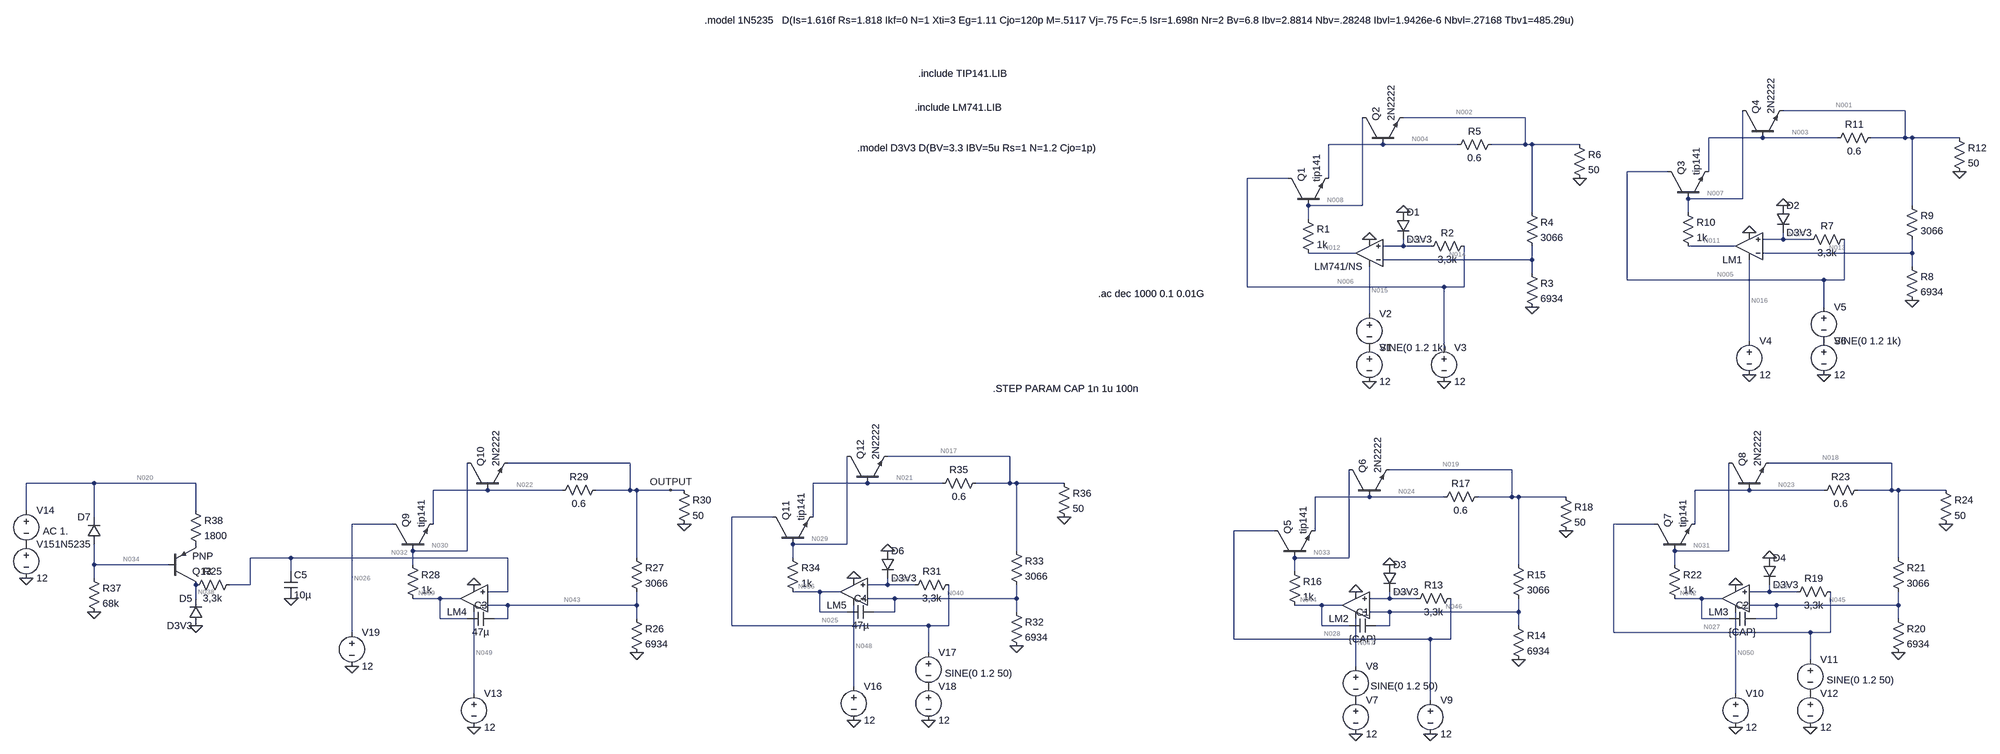
[diagram p0: schematic Estabilizador 5 V.asc]
Estabilizador 5 V.asc, the LTspice schematic file:
Version 4
SHEET 1 1496 1604
WIRE 1296 112 1008 112
WIRE 400 128 112 128
WIRE 960 176 832 176
WIRE 1136 176 960 176
WIRE 1296 176 1296 112
WIRE 1296 176 1216 176
WIRE 1312 176 1296 176
WIRE 1424 176 1312 176
WIRE 64 192 -64 192
WIRE 240 192 64 192
WIRE 400 192 400 128
WIRE 400 192 320 192
WIRE 416 192 400 192
WIRE 528 192 416 192
WIRE 736 256 640 256
WIRE 832 256 832 176
WIRE -160 272 -256 272
WIRE -64 272 -64 192
WIRE 912 320 912 112
WIRE 912 320 784 320
WIRE 16 336 16 128
WIRE 16 336 -112 336
WIRE 1312 336 1312 176
WIRE 416 352 416 192
WIRE 784 352 784 320
WIRE -112 368 -112 336
WIRE 1008 416 1008 400
WIRE 1008 416 960 416
WIRE 1072 416 1008 416
WIRE 112 432 112 416
WIRE 112 432 64 432
WIRE 176 432 112 432
WIRE 896 432 784 432
WIRE 0 448 -112 448
WIRE 1312 448 1312 416
WIRE 1312 448 960 448
WIRE 416 464 416 432
WIRE 416 464 64 464
WIRE 1312 480 1312 448
WIRE 416 496 416 464
WIRE 640 512 640 256
WIRE 1104 512 640 512
WIRE 1152 512 1152 416
WIRE 1152 512 1104 512
WIRE -256 528 -256 272
WIRE 208 528 -256 528
WIRE 256 528 256 432
WIRE 256 528 208 528
WIRE 1104 576 1104 512
WIRE 32 592 32 480
WIRE 928 656 928 464
WIRE 208 672 208 528
WIRE -816 928 -1104 928
WIRE -1712 944 -2000 944
WIRE 1264 944 976 944
WIRE 368 960 80 960
WIRE -2976 992 -3136 992
WIRE -2736 992 -2976 992
WIRE -1152 992 -1280 992
WIRE -976 992 -1152 992
WIRE -816 992 -816 928
WIRE -816 992 -896 992
WIRE -800 992 -816 992
WIRE -688 992 -800 992
WIRE -2048 1008 -2176 1008
WIRE -1872 1008 -2048 1008
WIRE -1712 1008 -1712 944
WIRE -1712 1008 -1792 1008
WIRE -1696 1008 -1712 1008
WIRE -1616 1008 -1696 1008
WIRE -1584 1008 -1616 1008
WIRE 928 1008 800 1008
WIRE 1104 1008 928 1008
WIRE 1264 1008 1264 944
WIRE 1264 1008 1184 1008
WIRE 1280 1008 1264 1008
WIRE 1392 1008 1280 1008
WIRE 32 1024 -96 1024
WIRE 208 1024 32 1024
WIRE 368 1024 368 960
WIRE 368 1024 288 1024
WIRE 384 1024 368 1024
WIRE 496 1024 384 1024
WIRE -3136 1056 -3136 992
WIRE -2736 1056 -2736 992
WIRE -2976 1072 -2976 992
WIRE -1376 1072 -1472 1072
WIRE -1280 1072 -1280 992
WIRE -2272 1088 -2368 1088
WIRE -2176 1088 -2176 1008
WIRE 704 1088 608 1088
WIRE 800 1088 800 1008
WIRE -192 1104 -288 1104
WIRE -96 1104 -96 1024
WIRE -1200 1136 -1200 928
WIRE -1200 1136 -1328 1136
WIRE -2096 1152 -2096 944
WIRE -2096 1152 -2224 1152
WIRE -800 1152 -800 992
WIRE 880 1152 880 944
WIRE 880 1152 752 1152
WIRE -2512 1168 -2608 1168
WIRE -2000 1168 -2512 1168
WIRE -1696 1168 -1696 1008
WIRE -1328 1168 -1328 1136
WIRE -16 1168 -16 960
WIRE -16 1168 -144 1168
WIRE 1280 1168 1280 1008
WIRE -2976 1184 -2976 1136
WIRE -2800 1184 -2976 1184
WIRE -2224 1184 -2224 1152
WIRE 384 1184 384 1024
WIRE 752 1184 752 1152
WIRE -2512 1200 -2512 1168
WIRE -144 1200 -144 1168
WIRE -2976 1216 -2976 1184
WIRE -2608 1232 -2608 1168
WIRE -2608 1232 -2656 1232
WIRE -1104 1232 -1104 1216
WIRE -1104 1232 -1152 1232
WIRE -1040 1232 -1104 1232
WIRE -2000 1248 -2000 1168
WIRE -2000 1248 -2048 1248
WIRE -1264 1248 -1328 1248
WIRE -1216 1248 -1264 1248
WIRE 976 1248 976 1232
WIRE 976 1248 928 1248
WIRE 1040 1248 976 1248
WIRE -2736 1264 -2736 1232
WIRE -2160 1264 -2224 1264
WIRE -2112 1264 -2160 1264
WIRE -1088 1264 -1152 1264
WIRE -800 1264 -800 1232
WIRE -800 1264 -1088 1264
WIRE 80 1264 80 1248
WIRE 80 1264 32 1264
WIRE 144 1264 80 1264
WIRE 816 1264 752 1264
WIRE 864 1264 816 1264
WIRE -2000 1280 -2048 1280
WIRE -1696 1280 -1696 1248
WIRE -1696 1280 -2000 1280
WIRE -80 1280 -144 1280
WIRE -32 1280 -80 1280
WIRE 992 1280 928 1280
WIRE 1280 1280 1280 1248
WIRE 1280 1280 992 1280
WIRE -1264 1296 -1264 1248
WIRE -1200 1296 -1264 1296
WIRE -1088 1296 -1088 1264
WIRE -1088 1296 -1136 1296
WIRE -800 1296 -800 1264
WIRE 80 1296 32 1296
WIRE 384 1296 384 1264
WIRE 384 1296 80 1296
WIRE -2160 1312 -2160 1264
WIRE -2096 1312 -2160 1312
WIRE -2000 1312 -2000 1280
WIRE -2000 1312 -2032 1312
WIRE -1696 1312 -1696 1280
WIRE 816 1312 816 1264
WIRE 880 1312 816 1312
WIRE 992 1312 992 1280
WIRE 992 1312 944 1312
WIRE 1280 1312 1280 1280
WIRE -1472 1328 -1472 1072
WIRE -1008 1328 -1472 1328
WIRE -960 1328 -960 1232
WIRE -960 1328 -1008 1328
WIRE -80 1328 -80 1280
WIRE -16 1328 -80 1328
WIRE 80 1328 80 1296
WIRE 80 1328 48 1328
WIRE 384 1328 384 1296
WIRE -2368 1344 -2368 1088
WIRE 608 1344 608 1088
WIRE 1072 1344 608 1344
WIRE 1120 1344 1120 1248
WIRE 1120 1344 1072 1344
WIRE -288 1360 -288 1104
WIRE 176 1360 -288 1360
WIRE 224 1360 224 1264
WIRE 224 1360 176 1360
WIRE -1008 1392 -1008 1328
WIRE 1072 1408 1072 1344
WIRE 0 1424 0 1312
WIRE -1184 1472 -1184 1280
WIRE -2080 1488 -2080 1296
WIRE 896 1488 896 1296
WIRE 176 1504 176 1360
FLAG 32 416 0
FLAG 32 752 0
FLAG 416 576 0
FLAG 112 352 0
FLAG 528 272 0
FLAG 208 752 0
FLAG 928 400 0
FLAG 928 736 0
FLAG 1312 560 0
FLAG 1008 336 0
FLAG 1424 256 0
FLAG 1104 736 0
FLAG 0 1248 0
FLAG 0 1584 0
FLAG 384 1408 0
FLAG 80 1184 0
FLAG 496 1104 0
FLAG 176 1584 0
FLAG 896 1232 0
FLAG 896 1568 0
FLAG 1280 1392 0
FLAG 976 1168 0
FLAG 1392 1088 0
FLAG 1072 1568 0
FLAG -2080 1232 0
FLAG -2080 1568 0
FLAG -1696 1392 0
FLAG -2736 1328 0
FLAG -1584 1088 0
FLAG -3136 1216 0
FLAG -1184 1216 0
FLAG -1184 1552 0
FLAG -800 1376 0
FLAG -1104 1152 0
FLAG -688 1072 0
FLAG -1008 1552 0
FLAG -2976 1296 0
FLAG -2368 1424 0
FLAG -2512 1264 0
FLAG -1616 1008 OUTPUT
SYMBOL npn -160 336 R270
SYMATTR InstName Q1
SYMATTR Value tip141
SYMATTR Prefix X
SYMBOL voltage 32 656 R0
WINDOW 123 0 0 Left 2
WINDOW 39 0 0 Left 2
SYMATTR InstName V1
SYMATTR Value 12
SYMBOL res 272 416 R90
WINDOW 0 0 56 VBottom 2
WINDOW 3 32 56 VTop 2
SYMATTR InstName R2
SYMATTR Value 3,3k
SYMBOL res 400 480 R0
SYMATTR InstName R3
SYMATTR Value 6934
SYMBOL res 400 336 R0
SYMATTR InstName R4
SYMATTR Value 3066
SYMBOL diode 96 352 R0
SYMATTR InstName D1
SYMATTR Value D3V3
SYMBOL res -128 352 R0
SYMATTR InstName R1
SYMATTR Value 1k
SYMBOL res 336 176 R90
WINDOW 0 0 56 VBottom 2
WINDOW 3 32 56 VTop 2
SYMATTR InstName R5
SYMATTR Value 0.6
SYMBOL res 512 176 R0
SYMATTR InstName R6
SYMATTR Value 50
SYMBOL npn 16 192 R270
SYMATTR InstName Q2
SYMATTR Value 2N2222
SYMBOL Opamps\\UniversalOpamp2 32 448 R180
SYMATTR InstName LM741/NS
SYMBOL voltage 32 576 R0
WINDOW 123 0 0 Left 2
WINDOW 39 0 0 Left 2
SYMATTR InstName V2
SYMATTR Value SINE(0 1.2 1k)
SYMBOL voltage 208 656 R0
WINDOW 123 0 0 Left 2
WINDOW 39 0 0 Left 2
SYMATTR InstName V3
SYMATTR Value 12
SYMBOL npn 736 320 R270
SYMATTR InstName Q3
SYMATTR Value tip141
SYMATTR Prefix X
SYMBOL voltage 928 640 R0
WINDOW 123 0 0 Left 2
WINDOW 39 0 0 Left 2
SYMATTR InstName V4
SYMATTR Value 12
SYMBOL res 1168 400 R90
WINDOW 0 0 56 VBottom 2
WINDOW 3 32 56 VTop 2
SYMATTR InstName R7
SYMATTR Value 3,3k
SYMBOL res 1296 464 R0
SYMATTR InstName R8
SYMATTR Value 6934
SYMBOL res 1296 320 R0
SYMATTR InstName R9
SYMATTR Value 3066
SYMBOL diode 992 336 R0
SYMATTR InstName D2
SYMATTR Value D3V3
SYMBOL res 768 336 R0
SYMATTR InstName R10
SYMATTR Value 1k
SYMBOL res 1232 160 R90
WINDOW 0 0 56 VBottom 2
WINDOW 3 32 56 VTop 2
SYMATTR InstName R11
SYMATTR Value 0.6
SYMBOL res 1408 160 R0
SYMATTR InstName R12
SYMATTR Value 50
SYMBOL npn 912 176 R270
SYMATTR InstName Q4
SYMATTR Value 2N2222
SYMBOL Opamps\\UniversalOpamp2 928 432 R180
SYMATTR InstName LM1
SYMBOL voltage 1104 560 R0
WINDOW 123 0 0 Left 2
WINDOW 39 0 0 Left 2
SYMATTR InstName V5
SYMATTR Value SINE(0 1.2 1k)
SYMBOL voltage 1104 640 R0
WINDOW 123 0 0 Left 2
WINDOW 39 0 0 Left 2
SYMATTR InstName V6
SYMATTR Value 12
SYMBOL npn -192 1168 R270
SYMATTR InstName Q5
SYMATTR Value tip141
SYMATTR Prefix X
SYMBOL voltage 0 1488 R0
WINDOW 123 0 0 Left 2
WINDOW 39 0 0 Left 2
SYMATTR InstName V7
SYMATTR Value 12
SYMBOL res 240 1248 R90
WINDOW 0 0 56 VBottom 2
WINDOW 3 32 56 VTop 2
SYMATTR InstName R13
SYMATTR Value 3,3k
SYMBOL res 368 1312 R0
SYMATTR InstName R14
SYMATTR Value 6934
SYMBOL res 368 1168 R0
SYMATTR InstName R15
SYMATTR Value 3066
SYMBOL diode 64 1184 R0
SYMATTR InstName D3
SYMATTR Value D3V3
SYMBOL res -160 1184 R0
SYMATTR InstName R16
SYMATTR Value 1k
SYMBOL res 304 1008 R90
WINDOW 0 0 56 VBottom 2
WINDOW 3 32 56 VTop 2
SYMATTR InstName R17
SYMATTR Value 0.6
SYMBOL res 480 1008 R0
SYMATTR InstName R18
SYMATTR Value 50
SYMBOL npn -16 1024 R270
SYMATTR InstName Q6
SYMATTR Value 2N2222
SYMBOL Opamps\\UniversalOpamp2 0 1280 R180
SYMATTR InstName LM2
SYMBOL voltage 0 1408 R0
WINDOW 3 35 63 Left 2
WINDOW 123 0 0 Left 2
WINDOW 39 0 0 Left 2
SYMATTR InstName V8
SYMATTR Value SINE(0 1.2 50)
SYMBOL voltage 176 1488 R0
WINDOW 123 0 0 Left 2
WINDOW 39 0 0 Left 2
SYMATTR InstName V9
SYMATTR Value 12
SYMBOL npn 704 1152 R270
SYMATTR InstName Q7
SYMATTR Value tip141
SYMATTR Prefix X
SYMBOL voltage 896 1472 R0
WINDOW 123 0 0 Left 2
WINDOW 39 0 0 Left 2
SYMATTR InstName V10
SYMATTR Value 12
SYMBOL res 1136 1232 R90
WINDOW 0 0 56 VBottom 2
WINDOW 3 32 56 VTop 2
SYMATTR InstName R19
SYMATTR Value 3,3k
SYMBOL res 1264 1296 R0
SYMATTR InstName R20
SYMATTR Value 6934
SYMBOL res 1264 1152 R0
SYMATTR InstName R21
SYMATTR Value 3066
SYMBOL diode 960 1168 R0
SYMATTR InstName D4
SYMATTR Value D3V3
SYMBOL res 736 1168 R0
SYMATTR InstName R22
SYMATTR Value 1k
SYMBOL res 1200 992 R90
WINDOW 0 0 56 VBottom 2
WINDOW 3 32 56 VTop 2
SYMATTR InstName R23
SYMATTR Value 0.6
SYMBOL res 1376 992 R0
SYMATTR InstName R24
SYMATTR Value 50
SYMBOL npn 880 1008 R270
SYMATTR InstName Q8
SYMATTR Value 2N2222
SYMBOL Opamps\\UniversalOpamp2 896 1264 R180
SYMATTR InstName LM3
SYMBOL voltage 1072 1392 R0
WINDOW 3 39 65 Left 2
WINDOW 123 0 0 Left 2
WINDOW 39 0 0 Left 2
SYMATTR InstName V11
SYMATTR Value SINE(0 1.2 50)
SYMBOL voltage 1072 1472 R0
WINDOW 123 0 0 Left 2
WINDOW 39 0 0 Left 2
SYMATTR InstName V12
SYMATTR Value 12
SYMBOL cap 48 1312 R90
WINDOW 0 0 32 VBottom 2
WINDOW 3 32 32 VTop 2
SYMATTR InstName C1
SYMATTR Value {CAP}
SYMBOL cap 944 1296 R90
WINDOW 0 0 32 VBottom 2
WINDOW 3 32 32 VTop 2
SYMATTR InstName C2
SYMATTR Value {CAP}
SYMBOL npn -2272 1152 R270
SYMATTR InstName Q9
SYMATTR Value tip141
SYMATTR Prefix X
SYMBOL voltage -2080 1472 R0
WINDOW 123 0 0 Left 2
WINDOW 39 0 0 Left 2
SYMATTR InstName V13
SYMATTR Value 12
SYMBOL res -2640 1216 R90
WINDOW 0 0 56 VBottom 2
WINDOW 3 32 56 VTop 2
SYMATTR InstName R25
SYMATTR Value 3,3k
SYMBOL res -1712 1296 R0
SYMATTR InstName R26
SYMATTR Value 6934
SYMBOL res -1712 1152 R0
SYMATTR InstName R27
SYMATTR Value 3066
SYMBOL diode -2720 1328 R180
WINDOW 0 24 64 Left 2
WINDOW 3 24 0 Left 2
SYMATTR InstName D5
SYMATTR Value D3V3
SYMBOL res -2240 1168 R0
SYMATTR InstName R28
SYMATTR Value 1k
SYMBOL res -1776 992 R90
WINDOW 0 0 56 VBottom 2
WINDOW 3 32 56 VTop 2
SYMATTR InstName R29
SYMATTR Value 0.6
SYMBOL res -1600 992 R0
SYMATTR InstName R30
SYMATTR Value 50
SYMBOL npn -2096 1008 R270
SYMATTR InstName Q10
SYMATTR Value 2N2222
SYMBOL Opamps\\UniversalOpamp2 -2080 1264 R180
SYMATTR InstName LM4
SYMBOL voltage -3136 1120 R0
WINDOW 123 0 0 Left 2
WINDOW 39 0 0 Left 2
SYMATTR InstName V15
SYMATTR Value 12
SYMBOL npn -1376 1136 R270
SYMATTR InstName Q11
SYMATTR Value tip141
SYMATTR Prefix X
SYMBOL voltage -1184 1456 R0
WINDOW 123 0 0 Left 2
WINDOW 39 0 0 Left 2
SYMATTR InstName V16
SYMATTR Value 12
SYMBOL res -944 1216 R90
WINDOW 0 0 56 VBottom 2
WINDOW 3 32 56 VTop 2
SYMATTR InstName R31
SYMATTR Value 3,3k
SYMBOL res -816 1280 R0
SYMATTR InstName R32
SYMATTR Value 6934
SYMBOL res -816 1136 R0
SYMATTR InstName R33
SYMATTR Value 3066
SYMBOL diode -1120 1152 R0
SYMATTR InstName D6
SYMATTR Value D3V3
SYMBOL res -1344 1152 R0
SYMATTR InstName R34
SYMATTR Value 1k
SYMBOL res -880 976 R90
WINDOW 0 0 56 VBottom 2
WINDOW 3 32 56 VTop 2
SYMATTR InstName R35
SYMATTR Value 0.6
SYMBOL res -704 976 R0
SYMATTR InstName R36
SYMATTR Value 50
SYMBOL npn -1200 992 R270
SYMATTR InstName Q12
SYMATTR Value 2N2222
SYMBOL Opamps\\UniversalOpamp2 -1184 1248 R180
SYMATTR InstName LM5
SYMBOL voltage -1008 1376 R0
WINDOW 3 39 65 Left 2
WINDOW 123 0 0 Left 2
WINDOW 39 0 0 Left 2
SYMATTR InstName V17
SYMATTR Value SINE(0 1.2 50)
SYMBOL voltage -1008 1456 R0
WINDOW 123 0 0 Left 2
WINDOW 39 0 0 Left 2
SYMATTR InstName V18
SYMATTR Value 12
SYMBOL cap -2032 1296 R90
WINDOW 0 0 32 VBottom 2
WINDOW 3 32 32 VTop 2
SYMATTR InstName C3
SYMATTR Value 47µ
SYMBOL cap -1136 1280 R90
WINDOW 0 0 32 VBottom 2
WINDOW 3 32 32 VTop 2
SYMATTR InstName C4
SYMATTR Value 47µ
SYMBOL diode -2960 1136 R180
WINDOW 0 24 64 Left 2
WINDOW 3 24 0 Left 2
SYMATTR InstName D7
SYMATTR Value 1N5235
SYMBOL res -2992 1200 R0
SYMATTR InstName R37
SYMATTR Value 68k
SYMBOL res -2752 1040 R0
SYMATTR InstName R38
SYMATTR Value 1800
SYMBOL pnp -2800 1232 M180
SYMATTR InstName Q13
SYMBOL voltage -2368 1328 R0
WINDOW 123 0 0 Left 2
WINDOW 39 0 0 Left 2
SYMATTR InstName V19
SYMATTR Value 12
SYMBOL voltage -3136 1040 R0
WINDOW 3 39 65 Left 2
WINDOW 123 0 0 Left 2
WINDOW 39 0 0 Left 2
SYMATTR InstName V14
SYMATTR Value AC 1.
SYMBOL cap -2528 1200 R0
SYMATTR InstName C5
SYMATTR Value 10µ
TEXT -1176 200 Left 2 !.model D3V3 D(BV=3.3 IBV=5u Rs=1 N=1.2 Cjo=1p)
TEXT -608 544 Left 2 !.ac dec 1000 0.1 0.01G
TEXT -1032 24 Left 2 !.include TIP141.LIB
TEXT -1040 104 Left 2 !.include LM741.LIB
TEXT -856 768 Left 2 !.STEP PARAM CAP 1n 1u 100n
TEXT -1536 -152 Left 2 !.model 1N5235   D(Is=1.616f Rs=1.818 Ikf=0 N=1 Xti=3 Eg=1.11 Cjo=120p M=.5117 Vj=.75 Fc=.5 Isr=1.698n Nr=2 Bv=6.8 Ibv=2.8814 Nbv=.28248 Ibvl=1.9426e-6 Nbvl=.27168 Tbv1=485.29u)

The netlist it stands for:
* Estabilizador 5 V.asc
XQ1 N006 N008 N004 tip141  ; pins C B E
V1 P001 0 12
R2 N006 N010 3,3k
R3 N014 0 6934
R4 N002 N014 3066
D1 0 N010 D3V3
R1 N008 N012 1k
R5 N002 N004 0.6
R6 N002 0 50
Q2 N008 N004 N002 0 2N2222
XLM741/NS N010 N014 N015 0 N012 level.2 Avol=1Meg GBW=10Meg Slew=10Meg ilimit=25m rail=0 Vos=0 phimargin=45 en=0 enk=0 in=0 ink=0 Rin=500Meg  ; pins IN+ IN- V+ V- OUT
V2 N015 P001 SINE(0 1.2 1k)
V3 N006 0 12
XQ3 N005 N007 N003 tip141  ; pins C B E
V4 N016 0 12
R7 N005 N009 3,3k
R8 N013 0 6934
R9 N001 N013 3066
D2 0 N009 D3V3
R10 N007 N011 1k
R11 N001 N003 0.6
R12 N001 0 50
Q4 N007 N003 N001 0 2N2222
XLM1 N009 N013 N016 0 N011 level.2 Avol=1Meg GBW=10Meg Slew=10Meg ilimit=25m rail=0 Vos=0 phimargin=45 en=0 enk=0 in=0 ink=0 Rin=500Meg  ; pins IN+ IN- V+ V- OUT
V5 N005 P002 SINE(0 1.2 1k)
V6 P002 0 12
XQ5 N028 N033 N024 tip141  ; pins C B E
V7 P003 0 12
R13 N028 N041 3,3k
R14 N046 0 6934
R15 N019 N046 3066
D3 0 N041 D3V3
R16 N033 N044 1k
R17 N019 N024 0.6
R18 N019 0 50
Q6 N033 N024 N019 0 2N2222
XLM2 N041 N046 N047 0 N044 level.2 Avol=1Meg GBW=10Meg Slew=10Meg ilimit=25m rail=0 Vos=0 phimargin=45 en=0 enk=0 in=0 ink=0 Rin=500Meg  ; pins IN+ IN- V+ V- OUT
V8 N047 P003 SINE(0 1.2 50)
V9 N028 0 12
XQ7 N027 N031 N023 tip141  ; pins C B E
V10 N050 0 12
R19 N027 N037 3,3k
R20 N045 0 6934
R21 N018 N045 3066
D4 0 N037 D3V3
R22 N031 N042 1k
R23 N018 N023 0.6
R24 N018 0 50
Q8 N031 N023 N018 0 2N2222
XLM3 N037 N045 N050 0 N042 level.2 Avol=1Meg GBW=10Meg Slew=10Meg ilimit=25m rail=0 Vos=0 phimargin=45 en=0 enk=0 in=0 ink=0 Rin=500Meg  ; pins IN+ IN- V+ V- OUT
V11 N027 P004 SINE(0 1.2 50)
V12 P004 0 12
C1 N046 N044 {CAP}
C2 N045 N042 {CAP}
XQ9 N026 N030 N022 tip141  ; pins C B E
V13 N049 0 12
R25 N032 N038 3,3k
R26 N043 0 6934
R27 OUTPUT N043 3066
D5 0 N038 D3V3
R28 N030 N039 1k
R29 OUTPUT N022 0.6
R30 OUTPUT 0 50
Q10 N030 N022 OUTPUT 0 2N2222
XLM4 N032 N043 N049 0 N039 level.2 Avol=1Meg GBW=10Meg Slew=10Meg ilimit=25m rail=0 Vos=0 phimargin=45 en=0 enk=0 in=0 ink=0 Rin=500Meg  ; pins IN+ IN- V+ V- OUT
V15 P005 0 12
XQ11 N025 N029 N021 tip141  ; pins C B E
V16 N048 0 12
R31 N025 N035 3,3k
R32 N040 0 6934
R33 N017 N040 3066
D6 0 N035 D3V3
R34 N029 N036 1k
R35 N017 N021 0.6
R36 N017 0 50
Q12 N029 N021 N017 0 2N2222
XLM5 N035 N040 N048 0 N036 level.2 Avol=1Meg GBW=10Meg Slew=10Meg ilimit=25m rail=0 Vos=0 phimargin=45 en=0 enk=0 in=0 ink=0 Rin=500Meg  ; pins IN+ IN- V+ V- OUT
V17 N025 P006 SINE(0 1.2 50)
V18 P006 0 12
C3 N043 N039 47µ
C4 N040 N036 47µ
D7 N034 N020 1N5235
R37 N034 0 68k
R38 N020 P007 1800
Q13 N038 N034 P007 0 PNP
V19 N026 0 12
V14 N020 P005 AC 1.
C5 N032 0 10µ
.model D D
.lib standard.dio
.model NPN NPN
.model PNP PNP
.lib standard.bjt
.model D3V3 D(BV=3.3 IBV=5u Rs=1 N=1.2 Cjo=1p)
.ac dec 1000 0.1 0.01G
.include TIP141.LIB
.include LM741.LIB
.STEP PARAM CAP 1n 1u 100n
.model 1N5235   D(Is=1.616f Rs=1.818 Ikf=0 N=1 Xti=3 Eg=1.11 Cjo=120p M=.5117 Vj=.75 Fc=.5 Isr=1.698n Nr=2 Bv=6.8 Ibv=2.8814 Nbv=.28248 Ibvl=1.9426e-6 Nbvl=.27168 Tbv1=485.29u)
.lib UniversalOpamps2.sub
.backanno
.end

* Results of the author's LTspice run, read from the files saved beside the schematic
* Operating Point (first step), zero values left out:
*   cap = 1 n
*   V(n006) = 12 V
*   V(n008) = 7.009 V
*   V(n004) = 5.06 V
*   V(p001) = 12 V
*   V(n010) = 3.467 V
*   V(n014) = 3.467 V
*   V(n002) = 5 V
*   V(n012) = 7.523 V
*   V(n015) = 12 V
*   V(n005) = 12 V
*   V(n007) = 7.009 V
*   V(n003) = 5.06 V
*   V(n016) = 12 V
*   V(n009) = 3.467 V
*   V(n013) = 3.467 V
*   V(n001) = 5 V
*   V(n011) = 7.523 V
*   V(p002) = 12 V
*   V(n028) = 12 V
*   V(n033) = 7.009 V
*   V(n024) = 5.06 V
*   V(p003) = 12 V
*   V(n041) = 3.467 V
*   V(n046) = 3.467 V
*   V(n019) = 5 V
*   V(n044) = 7.523 V
*   V(n047) = 12 V
*   V(n027) = 12 V
*   V(n031) = 7.009 V
*   V(n023) = 5.06 V
*   V(n050) = 12 V
*   V(n037) = 3.467 V
*   V(n045) = 3.467 V
*   V(n018) = 5 V
*   V(n042) = 7.523 V
*   V(p004) = 12 V
*   V(n026) = 12 V
*   V(n030) = 7.015 V
*   V(n022) = 5.066 V
*   V(n049) = 12 V
*   V(n032) = 3.471 V
*   V(n038) = 3.471 V
*   V(n043) = 3.471 V
*   V(output) = 5.005 V
*   V(n039) = 7.529 V
*   V(p005) = 12 V
*   V(n025) = 12 V
*   V(n029) = 7.009 V
*   V(n021) = 5.06 V
*   V(n048) = 12 V
*   V(n035) = 3.467 V
*   V(n040) = 3.467 V
*   V(n017) = 5 V
*   V(n036) = 7.523 V
*   V(p006) = 12 V
*   V(n034) = 5.281 V
*   V(n020) = 12 V
*   V(p007) = 6.086 V
*   Ic(Q13) = -3.253 mA
*   Ib(Q13) = -32.53 µA
*   Ie(Q13) = 3.286 mA
*   Ic(Q12) = 2.055 pA
*   Ib(Q12) = -1.892 pA
*   Ic(Q10) = 2.058 pA
*   Ib(Q10) = -1.892 pA
*   Ic(Q8) = 2.055 pA
*   Ib(Q8) = -1.892 pA
*   Ic(Q6) = 2.055 pA
*   Ib(Q6) = -1.892 pA
*   Ic(Q4) = 2.061 pA
*   Ib(Q4) = -1.892 pA
*   Ic(Q2) = 2.055 pA
*   Ib(Q2) = -1.892 pA
*   I(D7) = -45.13 µA
*   I(D6) = -2.844 mA
*   I(D5) = -3.253 mA
*   I(D4) = -2.844 mA
*   I(D3) = -2.844 mA
*   I(D2) = -2.844 mA
*   I(D1) = -2.844 mA
*   I(R38) = 3.286 mA
*   I(R37) = 77.66 µA
*   I(R36) = 100 mA
*   I(R35) = -100.5 mA
*   I(R34) = -513.7 µA
*   I(R33) = 500 µA
*   I(R32) = 500 µA
*   I(R31) = 2.844 mA
*   I(R30) = 100.1 mA
*   I(R29) = -100.6 mA
*   I(R28) = -513.7 µA
*   I(R27) = 500.5 µA
*   I(R26) = 500.6 µA
*   I(R25) = 5.058 nA
*   I(R24) = 100 mA
*   I(R23) = -100.5 mA
*   I(R22) = -513.7 µA
*   I(R21) = 500 µA
*   I(R20) = 500 µA
*   I(R19) = 2.844 mA
*   I(R18) = 100 mA
*   I(R17) = -100.5 mA
*   I(R16) = -513.7 µA
*   I(R15) = 500 µA
*   I(R14) = 500 µA
*   I(R13) = 2.844 mA
*   I(R12) = 100 mA
*   I(R11) = -100.5 mA
*   I(R10) = -513.7 µA
*   I(R9) = 500 µA
*   I(R8) = 500 µA
*   I(R7) = 2.844 mA
*   I(R6) = 100 mA
*   I(R5) = -100.5 mA
*   I(R1) = -513.7 µA
*   I(R4) = 500 µA
*   I(R3) = 500 µA
*   I(R2) = 2.844 mA
*   I(V14) = -3.331 mA
*   I(V19) = -100.1 mA
*   I(V18) = -102.8 mA
*   I(V17) = -102.8 mA
*   I(V16) = -891.4 µA
*   I(V15) = -3.331 mA
*   I(V13) = -891.3 µA
*   I(V12) = -102.8 mA
*   I(V11) = -102.8 mA
*   I(V10) = -891.4 µA
*   I(V9) = -102.8 mA
*   I(V8) = -891.4 µA
*   I(V7) = -891.4 µA
*   I(V6) = -102.8 mA
*   I(V5) = -102.8 mA
*   I(V4) = -891.4 µA
*   I(V3) = -102.8 mA
*   I(V2) = -891.4 µA
*   I(V1) = -891.4 µA